# Altium schematic sheet Morpheus_LDO.SchDoc: Gas Gaugre with LDO
size Letter; CompanyName: Hello Inc.; DrawnBy: Dyke Shaffer; Organization: Hello Inc.; Revision: EVT2; SheetNumber: 2; SheetTotal: 4
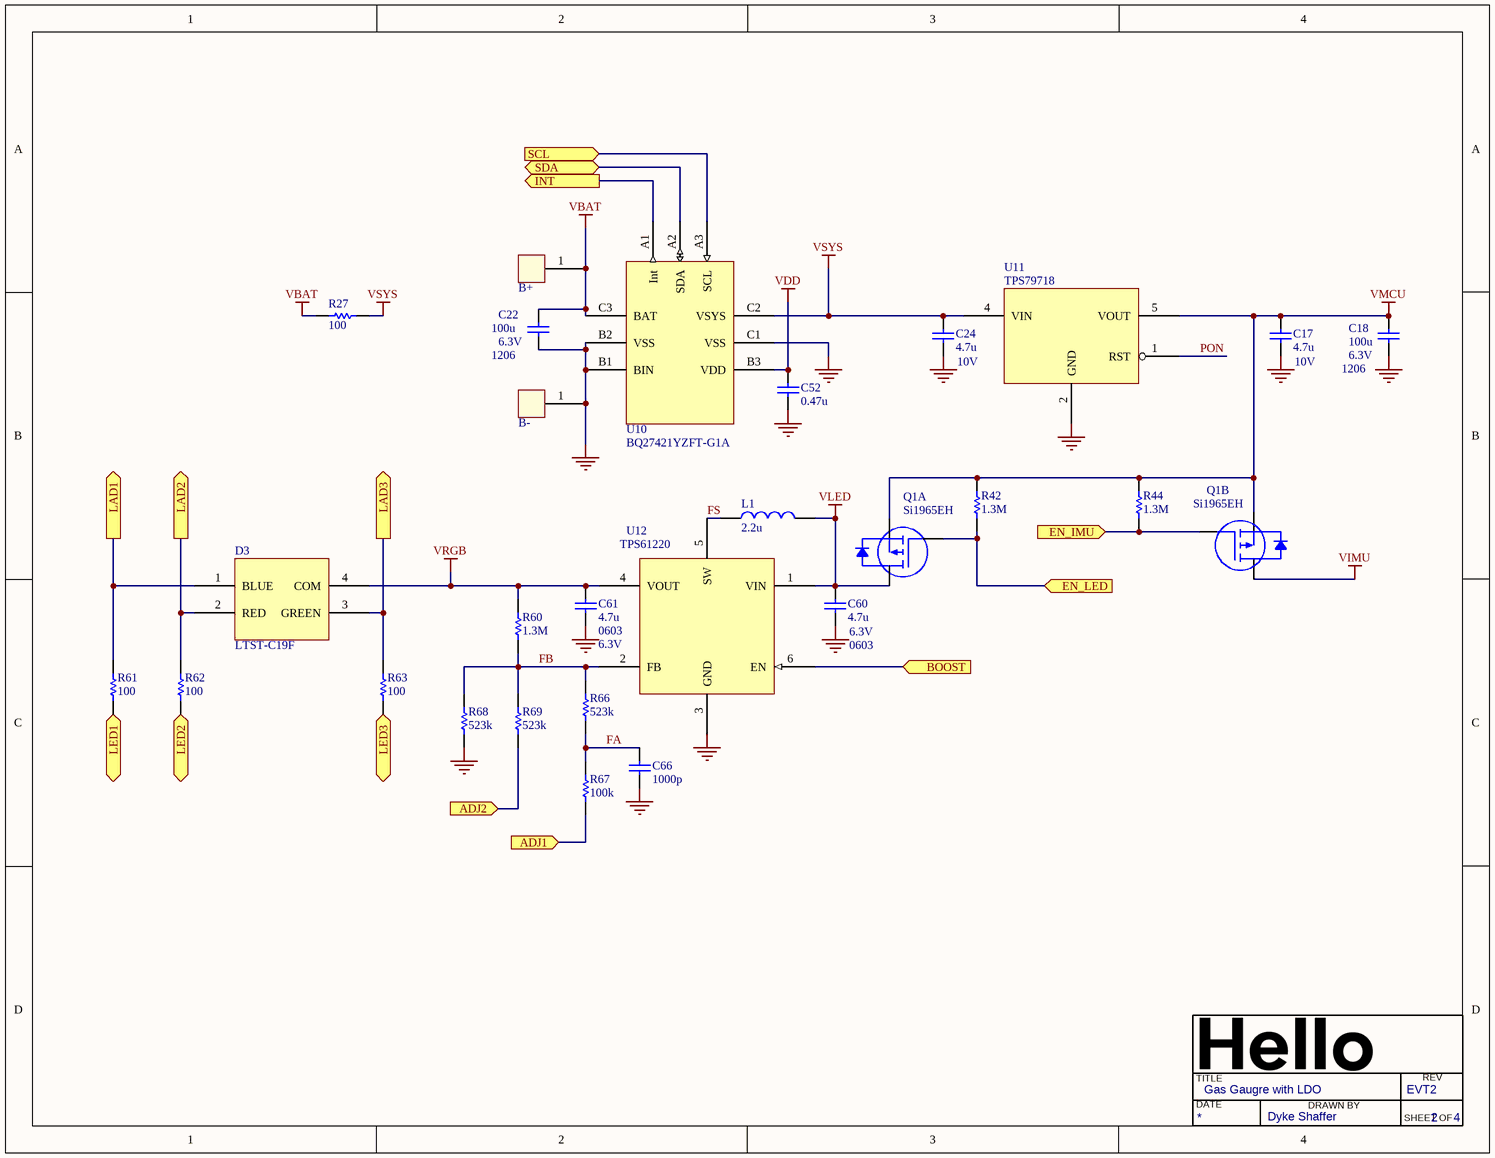
[diagram p0: Morpheus_LDO.SchDoc]

## Parts
B+  5016  [TP0875x050]  (value not drawn)
B-  5016  [TP0875x050]  (value not drawn)
C17  4.7u  Voltage: 10V  [CAP0402]
C18  100u  Size: 1206  Voltage: 6.3V  [CAP1206]
C22  100u  Size: 1206  Voltage: 6.3V  [CAP1206]
C24  4.7u  Voltage: 10V  [CAP0402]
C52  0.47u  [CAP0402]
C60  4.7u  Size: 0603  Voltage: 6.3V  [CAP0603]
C61  4.7u  Size: 0603  Voltage: 6.3V  [CAP0603]
C66  1000p  [CAP0402]
D3  LTST-C19F  [DFN165X210X160X80-4N]
L1  2.2u  [IND_1206]
Q1  Si1965EH  [SC-70-6]  (parts A,B of 2)
R27  100  [RES0402]
R42  1.3M  [RES0402]
R44  1.3M  [RES0402]
R60  1.3M  [RES0402]
R61  100  [RES0402]
R62  100  [RES0402]
R63  100  [RES0402]
R66  523k  [RES0402]
R67  100k  [RES0402]
R68  523k  [RES0402]
R69  523k  [RES0402]
U10  BQ27421YZFT-G1A  [BGA9C50P3X3_158X162X62]
U11  TPS79718  [SOT65P212X110-5N]
U12  TPS61220  [SOT65P212X110-6N]

## Ports
ADJ1 (in), ADJ2 (in), BOOST (in), EN_IMU (in), EN_LED (in), INT (out), LAD1 (out), LAD2 (out), LAD3 (out), LED1 (in), LED2 (in), LED3 (in), SCL (in), SDA

## Nets
GND: B-.1 C17.1 C18.1 C22.2 C24.1 C52.2 C60.1 C61.1 C66.1 R68.1 U10.B1(BIN) U10.B2(VSS) U10.C1(VSS) U11.2(GND) U12.3(GND)
VBAT: B+.1 C22.1 R27.2 U10.C3(BAT)
VDD: C52.1 U10.B3(VDD)
VIMU: Q1.3(D2)
VLED: C60.2 L1.1 Q1.6(D1) U12.1(VIN)
VMCU: C17.2 C18.2 Q1.1(S1) Q1.4(S2) R42.2 R44.2 U11.5(VOUT)
VRGB: C61.2 D3.4(COM) R60.2 U12.4(VOUT)
VSYS: C24.2 R27.1 U10.C2(VSYS) U11.4(VIN)
ADJ1: R67.1 ; port ADJ1
ADJ2: R69.1 ; port ADJ2
BOOST: U12.6(EN) ; port BOOST
EN_IMU: Q1.5(G2) R44.1 ; port EN_IMU
EN_LED: Q1.2(G1) R42.1 ; port EN_LED
FA: C66.2 R66.1 R67.2
FB: R60.1 R66.2 R68.2 R69.2 U12.2(FB)
FS: L1.2 U12.5(SW)
INT: U10.A1(Int) ; port INT
LAD1: D3.1(BLUE) R61.2 ; port LAD1
LAD2: D3.2(RED) R62.2 ; port LAD2
LAD3: D3.3(GREEN) R63.2 ; port LAD3
LED1: R61.1 ; port LED1
LED2: R62.1 ; port LED2
LED3: R63.1 ; port LED3
PON: U11.1(RST)
SCL: U10.A3(SCL) ; port SCL
SDA: U10.A2(SDA) ; port SDA

## Notes on the sheet
- TITLE
- DATE
- DRAWN BY
- REV
- SHEET
- OF

## Library data of the parts
B+ B- = 5016: Single-pad test point
C17 C24 = C_4.7u_10_10_JB_0402: Chip capacitor; Vendor: TDK; PN: C1005JB1A475K050BC; Tolerance: 10%; Temp: JB; Value: 4.7u; Size: 0402
C18 C22 = C_100u_20_6.3_X5R_1206: Chip capacitor; Vendor: TDK; PN: C3216X5R0J107M160AB; Tolerance: 20%; Temp: X5R; Value: 100u
C52 = C_0.47u_10_10_X5R_0402: Chip capacitor; Vendor: TDK; PN: LMK105BJ474KV-F; Tolerance: 10%; Voltage: 10V; Temp: X5R; Value: 0.47u; Size: 0402
C60 C61 = C_4.7u_20_6.3_X5R_0603: Chip capacitor; Vendor: Murata; PN: GRM188R60J475ME19D; Tolerance: 20%; Temp: X5R; Value: 4.7u
C66 = C_1000p_10_50_X7R_0402: Chip capacitor; Vendor: Murata; PN: GRM155R71H102KA01D; Tolerance: 10%; Voltage: 50V; Temp: X7R; Value: 1000p; Size: 0402
D3 = LTST-C19F: RGB LED Array
L1 = L_2.2u_1206: SMD power inductor, 2.2uH; PN: LQM31PN2R2M00; Vendor: Murata; Tolerance: 20%; RDC: 0.19; I_max: 0.9; I_sat: 1.0; Value: 2.2u; Q: ?
Q1 = Si1965EH: Vishay Dual P-Channel MOSFET 1.8v drive 20V 1A; PN: Si1965EH; Vendor: Vishay
R27 R61-R63 = R_100_1_0.1_0402: Chip Resistor; Vendor: Panasonic; Tolerance: 1 %; Power: 0.1 W; PN: ERJ-2RKF1000X; Model: *; Value: 100; Size: 0402
R42 R44 R60 = R_1.3M_5_0.1_0402_1: Chip Resistor; Vendor: Panasonic; Tolerance: 5 %; Power: 0.1 W; PN: ERJ-2GEJ135X; Model: *; Value: 1.3M; Size: 0402
R66 R68 R69 = R_523k_1_0.1_0402: Chip Resistor; Vendor: Panasonic; Tolerance: 1 %; Power: 0.1 W; PN: ERJ-2RKF5233X; Model: *; Value: 523k; Size: 0402
R67 = R_100k_1_0.1_0402: Chip Resistor; Vendor: Panasonic; Tolerance: 1 %; Power: 0.1 W; PN: ERJ-2RKF1003X; Model: *; Value: 100k; Size: 0402
U10 = BQ27421: TI Fuel Gauge With Integrated Sense Resistor
U11 = TPS79718DCK: LDO 1.8V SC70-5
U12 = TPS61220: Boost Converter